# Altium project rpi-can-hat.PrjPcb
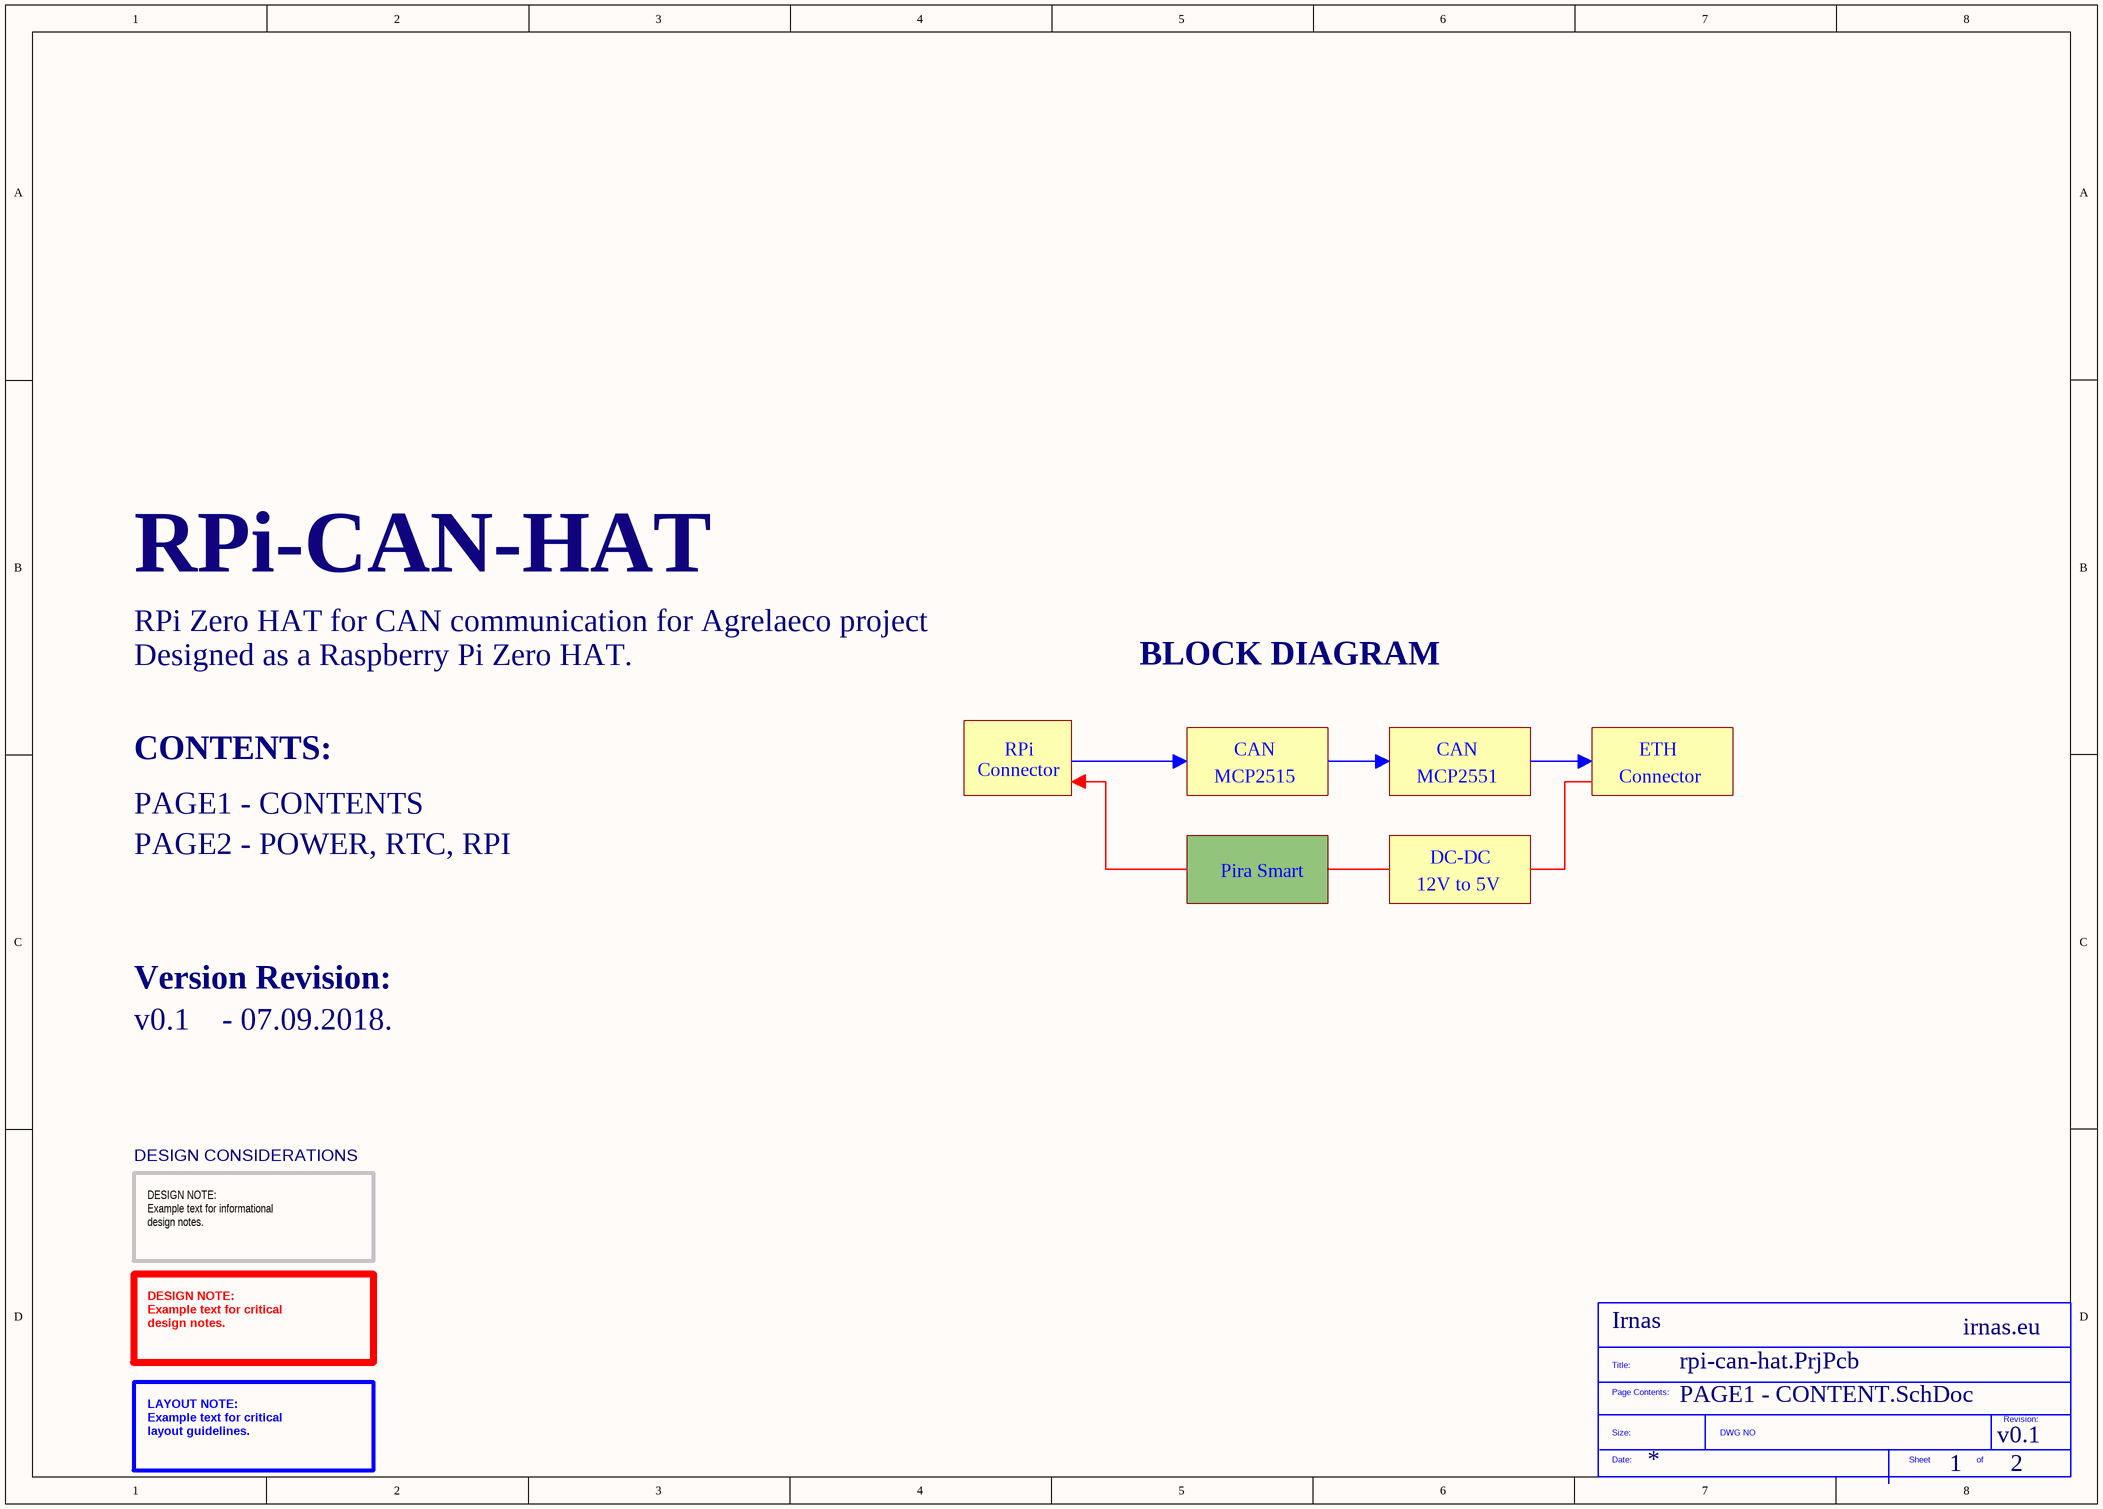
[diagram p0: PAGE1 - CONTENT.SchDoc]
Company: Irnas; ProjectTitle: RPi-CAN-HAT; Version: v0.1; Website: irnas.eu
2 sheets, 27 parts. Net scope: global (net labels, ports and power ports of the same name join across sheets).
Board file: rpi-can-hat.PcbDoc
Sheets:
  PAGE1 - CONTENT.SchDoc
  PAGE2 - RPI, CAN.SchDoc

## Sheet PAGE1 - CONTENT.SchDoc
size A3; DocumentNumber: 1; SheetNumber: 1; SheetTotal: 2

### Parts
(Parts that share a designator on the sheet are numbered #1, #2 ... from top to bottom, then left to right.)
*?#1  SDTitleBlock  (value not drawn)  (graphical)

### Notes on the sheet
- RPi Zero HAT for CAN communication for Agrelaeco project
- Designed as a Raspberry Pi Zero HAT.
- BLOCK DIAGRAM
- CONTENTS:
- Connector
- RPi
- MCP2515
- CAN
- MCP2551
- ETH
- PAGE1 - CONTENTS
- PAGE2 - POWER, RTC, RPI
- Pira Smart
- 12V to 5V
- DC-DC
- Version Revision:
- v0.1    - 07.09.2018.
- DESIGN CONSIDERATIONS
- DESIGN NOTE:
  Example text for informational
  design notes.
- DESIGN NOTE:
  Example text for critical
  design notes.
- LAYOUT NOTE:
  Example text for critical
  layout guidelines.
- (in symbol SDTitleBlock) Title:; Page Contents:; Revision:; Size:; DWG NO; Date:; Sheet; of

## Sheet PAGE2 - RPI, CAN.SchDoc
size A3; DocumentNumber: 2; SheetNumber: 2; SheetTotal: 2
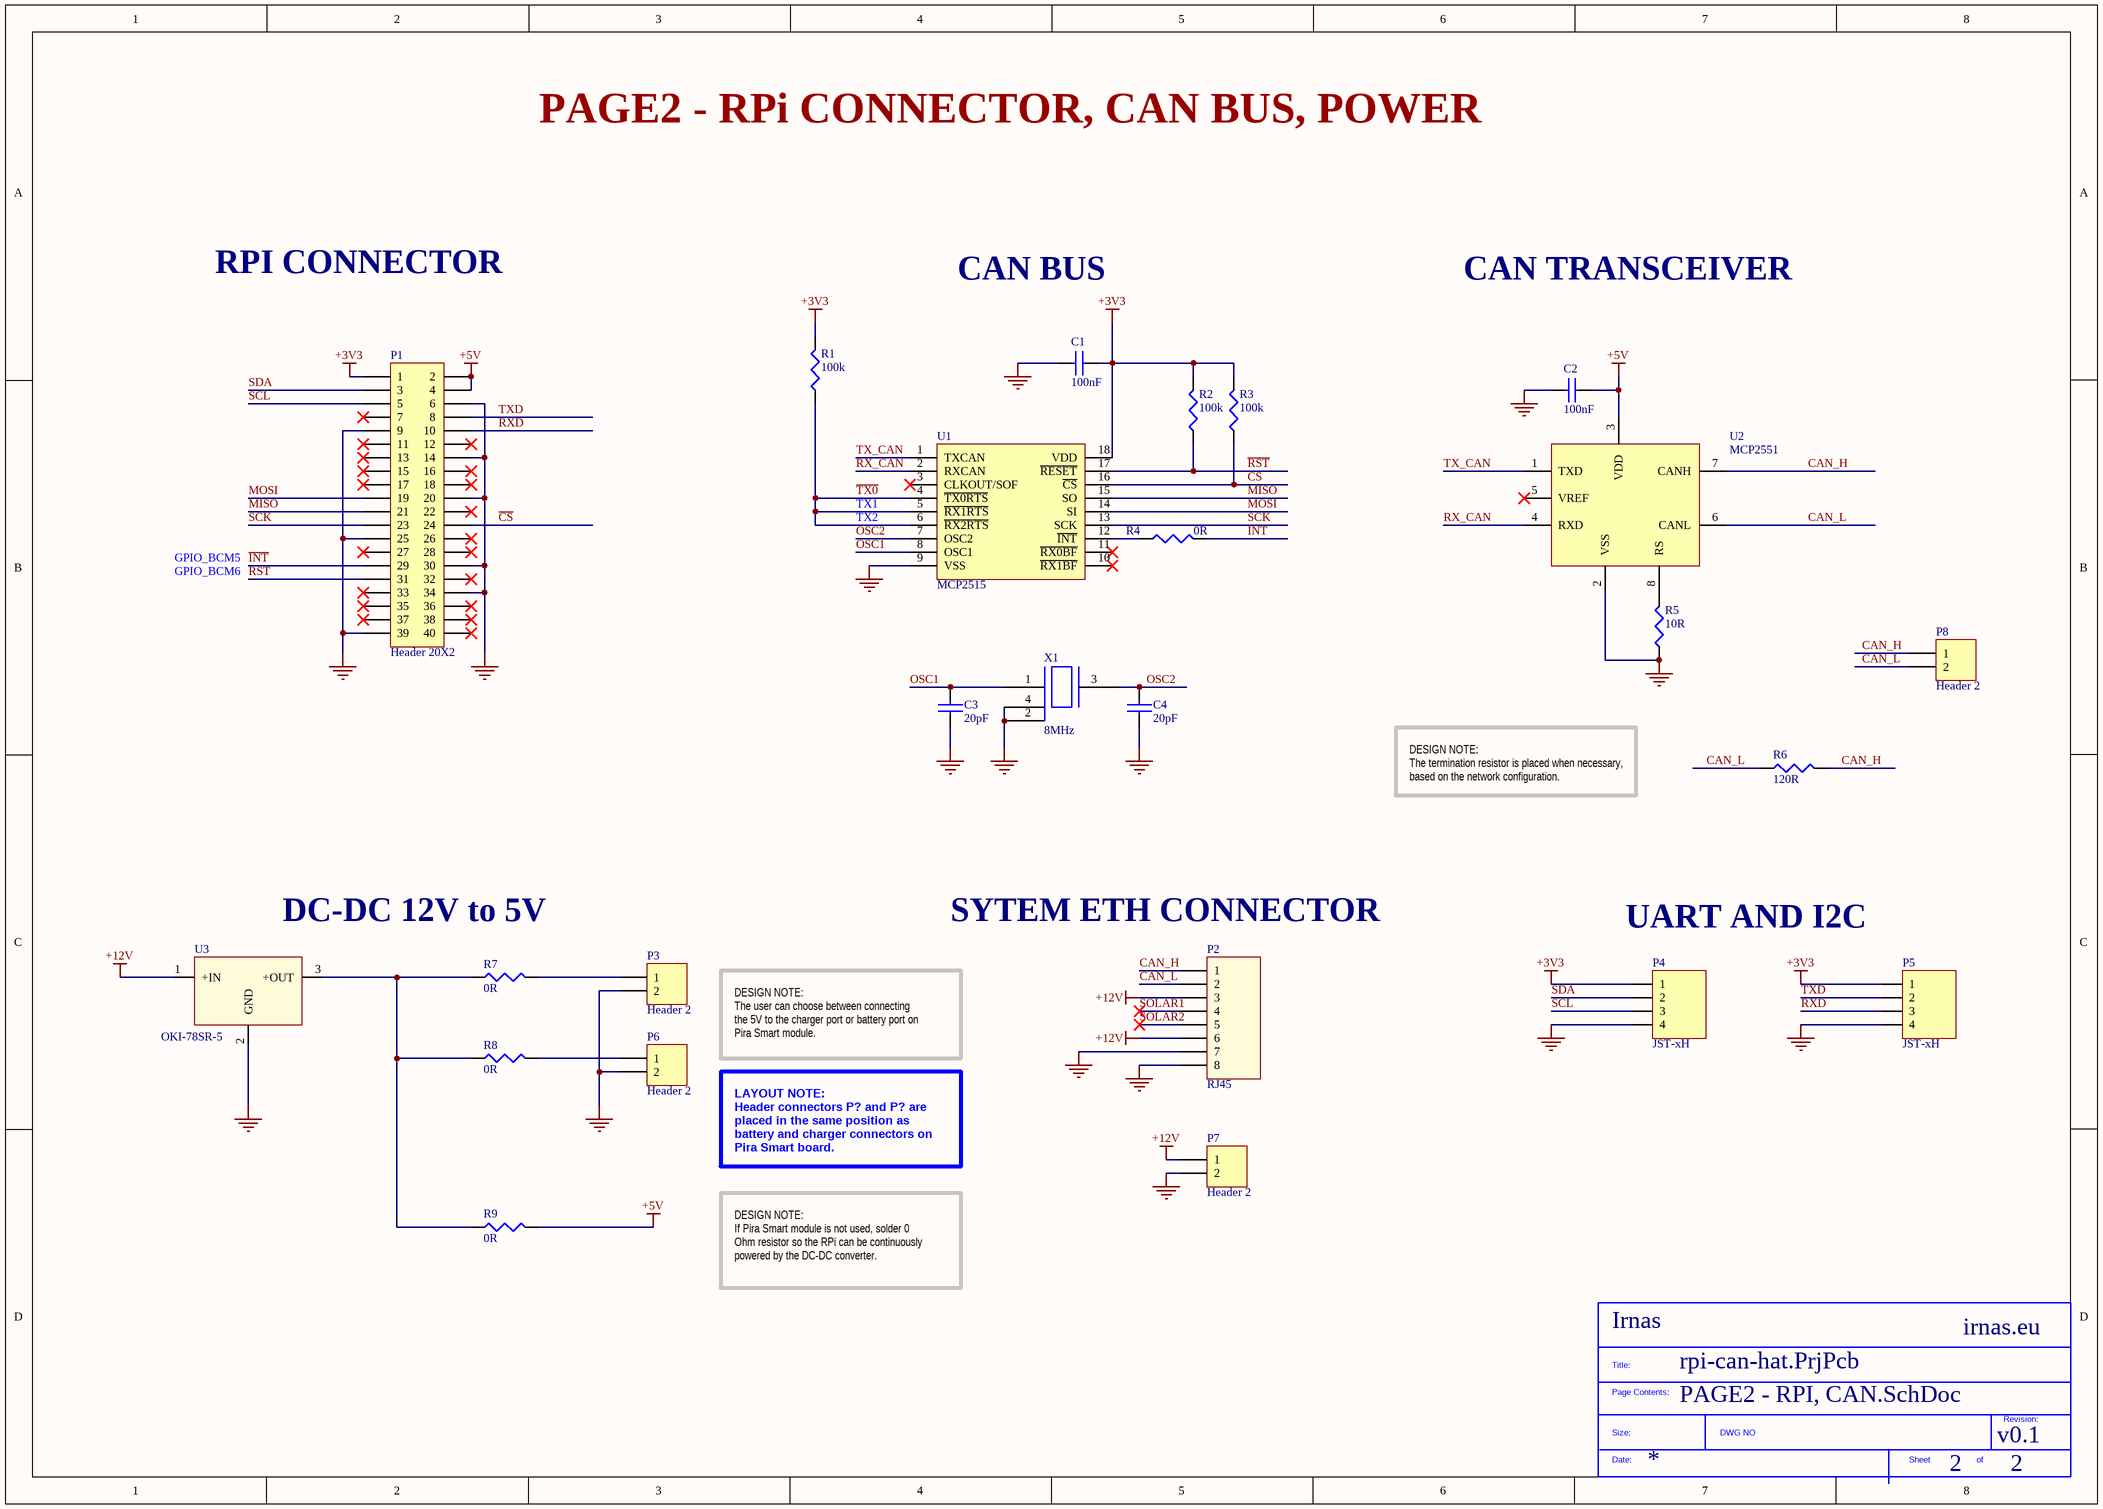
[diagram p1: PAGE2 - RPI, CAN.SchDoc]

### Parts
(Parts that share a designator on the sheet are numbered #1, #2 ... from top to bottom, then left to right.)
*?#2  SDTitleBlock  (value not drawn)  (graphical)
C1  100nF  [CAP0603]
C2  100nF  [CAP0603]
C3  20pF  [CAP0603]
C4  20pF  [CAP0603]
P1  Header 20X2  [HDR2X20]  (no BOM)
P2  RJ45  [EThernet conn]
P3  Header 2  [HDR1X2]
P4  JST-xH  [JST-xH]
P5  JST-xH  [JST-xH]
P6  Header 2  [HDR1X2]
P7  Header 2  [HDR1X2]
P8  Header 2  [HDR1X2]
R1  100k  [RES0603]
R2  100k  [RES0603]
R3  100k  [RES0603]
R4  0R  [RES0603]
R5  10R  [RES0603]
R6  120R  [RES0603]
R7  0R  [RES0603]
R8  0R  [RES0603]
R9  0R  [RES0603]
U1  MCP2515  [SOIC127P1030X264-18N]
U2  MCP2551  [SOIC127P600X175-8N]
U3  OKI-78SR-5  [DC-DC]
X1  8MHz  [DFN-Crystal]

### Nets
+3V3: C1.1 P1.1 P4.1 P5.1 R1.2 R2.2 R3.2 U1.18(VDD)
+5V: C2.1 P1.2 P1.4 R9.2 U2.3(VDD)
+12V: P2.3 P2.6 P7.1 U3.1(+IN)
GND: C1.2 C2.2 C3.1 C4.1 P1.6 P1.9 P1.14 P1.20 P1.25 P1.30 P1.34 P1.39 P2.7 P2.8 P3.2 P4.4 P5.4 P6.2 P7.2 R5.1 U1.9(VSS) U2.2(VSS) U3.2(GND) X1.2(GND) X1.4(GND)
~{CS}: P1.24 R3.1 U1.16(~{CS})
CAN_H: P2.1 P8.1 R6.2 U2.7(CANH)
CAN_L: P2.2 P8.2 R6.1 U2.6(CANL)
~{INT}: P1.29 R4.2
MISO: P1.21 U1.15(SO)
MOSI: P1.19 U1.14(SI)
OSC1: C3.2 U1.8(OSC1) X1.1
OSC2: C4.2 U1.7(OSC2) X1.3
~{RST}: P1.31 R2.1 U1.17(~{RESET})
RX_CAN: U1.2(RXCAN) U2.4(RXD)
RXD: P1.10 P5.3
SCK: P1.23 U1.13(SCK)
SCL: P1.5 P4.3
SDA: P1.3 P4.2
SOLAR1: P2.4
SOLAR2: P2.5
~{TX0}: R1.1 U1.4(~{TX0RTS}) U1.5(~{RX1RTS}) U1.6(~{RX2RTS})
TX_CAN: U1.1(TXCAN) U2.1(TXD)
TXD: P1.8 P5.2
NetP3_1: P3.1 R7.2
NetP6_1: P6.1 R8.2
NetR4_1: R4.1 U1.12(~{INT})
NetR5_2: R5.2 U2.8(RS)
NetR7_1: R7.1 R8.1 R9.1 U3.3(+OUT)

Not connected (* = marked no-connect by the designer): P1 7* 11* 12* 13* 15* 16* 17* 18* 22* 26* 27* 28* 32* 33* 35* 36* 37* 38* 40*; U1 3(CLKOUT/SOF)* 10(~{RX1BF})* 11(~{RX0BF})*; U2 5(VREF)*

### Notes on the sheet
- PAGE2 - RPi CONNECTOR, CAN BUS, POWER
- RPI CONNECTOR
- CAN BUS
- CAN TRANSCEIVER
- TX1
- GPIO_BCM5
- GPIO_BCM6
- TX2
- DESIGN NOTE:
  The termination resistor is placed when necessary, based on the network configuration.
- DC-DC 12V to 5V
- (near P2) SYTEM ETH CONNECTOR
- (near P4) UART AND I2C
- DESIGN NOTE:
  The user can choose between connecting the 5V to the charger port or battery port on Pira Smart module.
- LAYOUT NOTE:
  Header connectors P? and P? are placed in the same position as battery and charger connectors on Pira Smart board.
- DESIGN NOTE:
  If Pira Smart module is not used, solder 0 Ohm resistor so the RPi can be continuously powered by the DC-DC converter.
- (in symbol SDTitleBlock) Title:; Page Contents:; Revision:; Size:; DWG NO; Date:; Sheet; of

### Library data of the parts
C1 C2 = 100nF: MURATA - GRM188R71C104KA01J - CAP, MLCC, X7R, 0.1UF, 16V, 0603; Ceramic Capacitor Case: 0603 [1608 Metric]; Capacitance: 0.1; Voltage Rating: 16; Capacitance Tolerance: ± 10%; Dielectric Characteristic: X7; Product Range: GRM Series; SVHC: No SVHC (20-Jun-2016; Supplier 1: Farnell; Manufacturer: MURATA; Manufacturer Part Number: GRM188R71C104KA01J; RoHS: YES; Stock 1: 18297; Pricing 1: 10=0.0145, 100=0.0126, 500=0.0081, 2500=0.0059, 5000=0.0052, 10000=0.0046, 50000=0.0036, 100000=0.0035 (GBP); Packaging: Cut Tape; Operating Temperature Min: -55; Operating Temperature Max: 125; Automotive Qualification Standard: -; MSL: MSL 1 - Unlimited; ComponentLink1URL: http://www.farnell.com/datasheets/2189124.pdf; ComponentLink1Description: http://www.farnell.com/datasheets/2189124.pdf; Supplier Part Number 1: 2688519
C3 C4 = 20pF: MURATA - GRM1885C1H200JA01D - CAPACITOR, MLCC, C0G, 20PF, 50V, 0603; Ceramic Capacitor Case: 0603 [1608 Metric]; Capacitance: 20; Voltage Rating: 50; Capacitance Tolerance: ± 5%; Dielectric Characteristic: C0G / NP0; Product Range: GRM Series; SVHC: No SVHC (17-Dec-2015; Supplier 1: Farnell; Manufacturer: MURATA; Manufacturer Part Number: GRM1885C1H200JA01D; RoHS: YES; Stock 1: 5812; Pricing 1: 10=0.0245, 100=0.0159, 500=0.0123, 1000=0.0095, 2000=0.0093, 4000=0.0073, 20000=0.0062, 40000=0.0057 (GBP); Packaging: Cut Tape; Operating Temperature Min: -55; Operating Temperature Max: 125; Automotive Qualification Standard: -; MSL: MSL 1 - Unlimited; ComponentLink1URL: http://www.farnell.com/datasheets/2048077.pdf; ComponentLink1Description: http://www.farnell.com/datasheets/2048077.pdf; Supplier Part Number 1: 2456108
P1 = Header 20X2: Header, 20-Pin, Dual row; LatestRevisionDate: 17-Jul-2002; LatestRevisionNote: Re-released for DXP Platform.; Publisher: Altium Limited
P2 = 44620-0001: MODULAR JACK; Manufacturer: Molex; Number of Contacts: 8; Rad Hard: No; Gender: RCP; Pitch: 2.04 mm; Body Orientation: Right Angle; Supplier 1: Farnell; Manufacturer Part Number: 44620-0001; Stock 1: 1202; Pricing 1: 1=0.689, 50=0.675, 100=0.67, 250=0.669, 500=0.668, 1000=0.667 (EUR); Type: RJ-45; Termination Method: Solder; Mounting: Through Hole; Category: Connector Telephone and Telecom; ComponentLink1URL: https://datasheet.ciiva.com/26929/getdatasheetpartid-767379-26929525.pdf; ComponentLink1Description: https://datasheet.ciiva.com/26929/getdatasheetpartid-767379-26929525.pdf; ComponentLink2URL: https://datasheet.ciiva.com/19472/2040276-19472615.pdf; ComponentLink2Description: https://datasheet.ciiva.com/19472/2040276-19472615.pdf; ComponentLink3URL: https://datasheet.ciiva.com/30213/71510446200001-modular-jacks-plug-30213975.pdf; ComponentLink3Description: https://datasheet.ciiva.com/30213/71510446200001-modular-jacks-plug-30213975.pdf; ComponentLink4URL: https://datasheet.ciiva.com/4562/0446200001-modular-jacks-plug-145952-4562632.pdf; ComponentLink4Description: https://datasheet.ciiva.com/4562/0446200001-modular-jacks-plug-145952-4562632.pdf; ComponentLink5URL: https://datasheet.ciiva.com/16074/832720446200001-modular-jacks-plug-16074650.pdf; ComponentLink5Description: https://datasheet.ciiva.com/16074/832720446200001-modular-jacks-plug-16074650.pdf; ComponentLink6URL: https://datasheet.ciiva.com/1107/66995-1107778.pdf; ComponentLink6Description: https://datasheet.ciiva.com/1107/66995-1107778.pdf; ComponentLink7URL: https://datasheet.ciiva.com/9393/0446200001-modular-jacks-plug-9393019.pdf; ComponentLink7Description: https://datasheet.ciiva.com/9393/0446200001-modular-jacks-plug-9393019.pdf; ComponentLink8URL: https://datasheet.ciiva.com/16649/0446200001-modular-jacks-plug-16649582.pdf; ComponentLink8Description: https://datasheet.ciiva.com/16649/0446200001-modular-jacks-plug-16649582.pdf; Supplier Part Number 1: 2782009
P3 P6-P8 = Header 2: Header, 2-Pin; LatestRevisionDate: 17-Jul-2002; LatestRevisionNote: Re-released for DXP Platform.; Publisher: Altium Limited
P4 P5 = B4B-XH-A(LF)(SN): 4 Positions Header, Shrouded Connector 0.098" (2.50mm) Through Hole Tin; Manufacturer: JST; No of Positions: 4; Pitch: 2.5 mm; Style/Orientation: Straight Header/Plug; Voltage Rating: 250 V; Current Rating: 3 A; No of Rows: 1; Gender: Male; Mating Type: Detent Lock; Insulation Resistance: 1000 MΩ; Supplier 1: Farnell; Manufacturer Part Number: B4B-XH-A(LF)(SN); Stock 1: 0; Termination: Crimp; Operating Temp Range: -25 to +85 °C; Contact Material: Brass; Contact Plating: Tin; Material: Polyamide; Type: Shrouded Header; Color: Natural; ComponentLink1URL: https://datasheet.ciiva.com/26894/getdatasheetpartid-455616-26894787.pdf; ComponentLink1Description: https://datasheet.ciiva.com/26894/getdatasheetpartid-455616-26894787.pdf; ComponentLink2URL: https://datasheet.ciiva.com/26924/getdatasheetpartid-640571-26924035.pdf; ComponentLink2Description: https://datasheet.ciiva.com/26924/getdatasheetpartid-640571-26924035.pdf; ComponentLink3URL: https://datasheet.ciiva.com/16203/b4b-xh-alfsn-16203642.pdf; ComponentLink3Description: https://datasheet.ciiva.com/16203/b4b-xh-alfsn-16203642.pdf; ComponentLink4URL: https://datasheet.ciiva.com/726/exh-726404.pdf; ComponentLink4Description: https://datasheet.ciiva.com/726/exh-726404.pdf; Supplier Part Number 1: 1516278
R1-R3 = 100k: MULTICOMP - MCMR06X104 JTL - RES, CERAMIC, 100K, 5%, 0.1W, 0603; Resistance: 100; Voltage Rating: 75; Resistor Case Style: 0603 [1608 Metric]; Product Range: MCMR Series; Temperature Coefficient: ± 100; Resistor Mounting: Surface Mount Device<!--FANDB--><div class="features-and-benefits-container"><div class="features-and-benefits-description"><span class="features-benefits-value">The Multicomp MCMR series resistors are automotive grade, anti sulphured thick film chip resistor. The resistance range includes E24 and E96 decade values from 1ohm to 10Mohm. These resistors are constructed on top of a high grade ceramic body.</span></div><div class="features-and-benefits-list"><ul class="features-and-benefits-list-list"><li class="features-and-benefits-list-item">EIA 0402, 0603, 0805, 1206 chip sizes available</li><li class="features-and-benefits-list-item">High reliability and stability</li><li class="features-and-benefits-list-item">Automotive grade AEC-Q200 compliant</li><li class="features-and-benefits-list-item">Complaint with (IEC 60068-1) 55/155/56 climatic category</li><li class="features-and-benefits-list-item">Maximum operation voltage of 50V, 75V, 150V and 200V</li><li class="features-and-benefits-list-item">Power rating of 62.5mW, 100mW, 125mW and 250mW</li><li class="features-and-benefits-list-item">Available in ±1% and ±5% tolerance</li><li class="features-and-benefits-list-item">Temperature coefficient (TCR) of +200ppm/°C, +100ppm/°C and -200ppm/°C to +400ppm/°C</li><li class="features-and-benefits-list-item">Operating temperature range -55°C to 155; Supplier 1: Farnell; Manufacturer: MULTICOMP; Manufacturer Part Number: MCMR06X104 JTL; RoHS: Y-EX; Stock 1: 187; Pricing 1: 10=0.0109, 100=0.0085, 500=0.006, 1000=0.0048, 2500=0.004, 5000=0.003, 25000=0.002, 50000=0.0016 (GBP); Power Rating: 100; Resistance Tolerance: ± 5%; Packaging: Cut Tape; Resistor Element Material: Ceramic; Automotive Qualification Standard: -; ComponentLink1URL: http://www.farnell.com/datasheets/1716707.pdf; ComponentLink1Description: http://www.farnell.com/datasheets/1716707.pdf; Supplier Part Number 1: 2073357
R4 R7-R9 = 0R: BOURNS - CR0603-J/-000ELF - RES, THICK FILM, 0R, 5%, 0.1W, 0603; Resistance: 0; Voltage Rating: 50; Resistor Case Style: 0603 [1608 Metric]; Power Rating: 100; Product Range: CR Series; SVHC: No SVHC (17-Dec-2015); Resistor Mounting: Surface Mount Device<!--FANDB--><div class="features-and-benefits-container"><div class="features-and-benefits-description"><span class="features-benefits-value">The Bourns CR series are standard thick film chip resistors. These resistors provide flexibility of performance, space saving and low cost. The Resistance range includes E96 and E24 decade values from 1ohm to 10Mohm.</span></div><div class="features-and-benefits-list"><ul class="features-and-benefits-list-list"><li class="features-and-benefits-list-item">0201, 0402, 0603, 0805, 1206, 1210, 2010, 2512 standard case sizes available</li><li class="features-and-benefits-list-item">±1% and ±5% tolerance</li><li class="features-and-benefits-list-item">±100ppm/°C, ±200ppm/°C and ±250ppm/°C TCR values available</li><li class="features-and-benefits-list-item">Power rating selectable for 50mW, 63mW, 0.1W, 0.125W, 0.25W, 0.5W and 1W based on ordering</li><li class="features-and-benefits-list-item">Jumpers are available for all size</li><li class="features-and-benefits-list-item">3 layer termination process with nickel barrier prevents leaching & provides excellent solderability</li><li class="features-and-benefits-list-item">Suitable for all type of soldering processes</li><li class="features-and-benefits-list-item">Tight dimensional tolerances</li><li class="features-and-benefits-list-item">Maximum working voltage depends on case size</li><li class="features-and-benefits-list-item">Operating temperature of -55°C to +125°C(CR0201) and -55°C to +155; Supplier 1: Farnell; Manufacturer: BOURNS; Manufacturer Part Number: CR0603-J/-000ELF; RoHS: YES; Stock 1: 58200; Pricing 1: 10=0.0146, 250=0.0097, 1000=0.0073, 5000=0.0049, 12500=0.0042 (GBP); Resistance Tolerance: ± 5%; Packaging: Cut Tape; Resistor Element Material: Thick Film; Temperature Coefficient: -; Automotive Qualification Standard: -; MSL: MSL 1 - Unlimited; ComponentLink1URL: http://www.bourns.com/engineering/CHPREZTR/cr0603.stp; ComponentLink1Description: http://www.bourns.com/engineering/CHPREZTR/cr0603.stp; ComponentLink2URL: http://www.farnell.com/datasheets/2178762.pdf; ComponentLink2Description: http://www.farnell.com/datasheets/2178762.pdf; Supplier Part Number 1: 2008343
R5 = 10R: VISHAY - RCA060310R0FKEA - RES, AUTO, THICK FILM, 10R, 1%, 0603; Resistance: 10; Voltage Rating: 75; Resistor Case Style: 0603 [1608 Metric]; Power Rating: 100; Product Range: RCA Series; Temperature Coefficient: ± 100; Automotive Qualification Standard: AEC-Q200; SVHC: No SVHC (17-Dec-2015)<!--FANDB--><div class="features-and-benefits-container"><div class="features-and-benefits-description"><span class="features-benefits-value">The RCA series from Vishay are automotive grade, sulphur resistant thick film rectangular chip resistors. The resistance range includes E24 and E96 decade values from 1ohm to 10Mohm. They provide superior resistance against H2S atmosphere. These resistors have metal glaze on high quality ceramic.</span></div><div class="features-and-benefits-list"><ul class="features-and-benefits-list-list"><li class="features-and-benefits-list-item">Automotive grade AEC-Q200 qualified (rev C)</li><li class="features-and-benefits-list-item">EIA 0402, 0603, 0805, 1206, 1210, 1218, 2010 and 2512 case sizes available</li><li class="features-and-benefits-list-item">Available in ±0.5%, ±1% and ±5% tolerances</li><li class="features-and-benefits-list-item">Jumpers are also available</li><li class="features-and-benefits-list-item">±50ppm/K, ±100ppm/K and ±200ppm/K TCR values</li><li class="features-and-benefits-list-item">Power rating of 0.063W, 0.10W, 0.125W, 0.25W, 0.5W, 0.75W and 1W at 70?C</li><li class="features-and-benefits-list-item">Available in 50V, 75V, 150V, 200V, 400V and 500V limiting voltage options</li><li class="features-and-benefits-list-item">Category temperature range from -55?C to 155?C</li><li class="features-and-benefits-list-item">Stability ?R/R = 1 % for 1000h at 70; Supplier 1: Farnell; Manufacturer: VISHAY; Manufacturer Part Number: RCA060310R0FKEA; RoHS: YES; Stock 1: 9559; Pricing 1: 10=0.0803, 100=0.0386, 500=0.0235, 2500=0.015, 5000=0.0135, 10000=0.0108, 50000=0.0068, 100000=0.0067 (GBP); Resistance Tolerance: ± 1%; Packaging: Cut Tape; Resistor Element Material: Thick Film; ComponentLink1URL: http://www.farnell.com/datasheets/2111201.pdf; ComponentLink1Description: http://www.farnell.com/datasheets/2111201.pdf; Supplier Part Number 1: 2616585
R6 = 120R: RES SMD 120 OHM 1% 1/4W 0603; Manufacturer: Vishay; Manufacturer Part Number: CRCW0603120RFKEAHP; Voltage Rating: 75V; Power Rating: 250mW; Temperature Coefficient: 100ppm/°C; Supplier 1: Farnell; Stock 1: 34760; Pricing 1: 10=0.141, 100=0.0937, 500=0.0669, 1000=0.0453 (EUR); Case/Package: 0603; Contact Plating: Tin; Case Code (Metric): 1608; Case Code (Imperial): 0603; Min Operating Temperature: -55°C; Max Operating Temperature: 155°C; Package Quantity: 5000; Packaging: Tape and Reel; Termination: SMD/SMT; Resistance: 120R; Tolerance: 1%; Composition: Thick Film; Number of Terminations: 2; Military Standard: Not; Max Power Dissipation: 250mW; Features: Automotive AEC-Q200; Length: 1.6mm; Height: 0.022inch; Width: 0.033inch; Depth: 0.85mm; Radiation Hardening: No; REACH SVHC: Unknown; ComponentLink1URL: https://datasheet.ciiva.com/5852/424479-5852064.pdf; ComponentLink1Description: https://datasheet.ciiva.com/5852/424479-5852064.pdf; ComponentLink2URL: https://datasheet.ciiva.com/2578/crcwhpe3-2578529.pdf; ComponentLink2Description: https://datasheet.ciiva.com/2578/crcwhpe3-2578529.pdf; ComponentLink3URL: https://datasheet.ciiva.com/8975/crcwhpe3-8975275.pdf; ComponentLink3Description: https://datasheet.ciiva.com/8975/crcwhpe3-8975275.pdf; ComponentLink4URL: https://datasheet.ciiva.com/7777/424479-7777277.pdf; ComponentLink4Description: https://datasheet.ciiva.com/7777/424479-7777277.pdf; ComponentLink5URL: https://datasheet.ciiva.com/7777/424479-7777278.pdf; ComponentLink5Description: https://datasheet.ciiva.com/7777/424479-7777278.pdf; Supplier Part Number 1: 1738892
U1 = MCP2515-I/SO: MICROCHIP         MCP2515-I/SO             CAN Bus, Controller, SPI, 3, 2, 2.7 V, 5.5 V, SOIC; Interface: SPI,CAN; Number of Transmit Buffers: 3; Number of Receive Buffers: 2; Min Supply Voltage: 2.7V; Max Supply Voltage: 5.5V; Data Rate: 1Mbps; Nominal Supply Current: 10mA; Operating Supply Voltage: 5V; Number of Transceivers: 1; Frequency: 40MHz; Supplier 1: Farnell; Manufacturer: Microchip; Manufacturer Part Number: MCP2515-I/SO; Stock 1: 2836; Pricing 1: 1=1.4, 10=1.29, 25=1.17, 100=1.06 (GBP); Mount: Surface Mount; Case/Package: SOIC; Number of Pins: 18; Contact Plating: Tin,Matte; Min Operating Temperature: -40°C; Max Operating Temperature: 85°C; Packaging: Rail/Tube; Max Supply Current: 10mA; Number of Drivers: 1; Number of Receivers: 1; Length: 11.53mm; Height: 2.31mm; Width: 7.49mm; Radiation Hardening: No; Lead Free: Lead Free; REACH SVHC: No SVHC; ComponentLink1URL: https://datasheet.ciiva.com/14152/ea644222-e-14152533.pdf; ComponentLink1Description: https://datasheet.ciiva.com/14152/ea644222-e-14152533.pdf; ComponentLink2URL: https://datasheet.ciiva.com/15150/getdatasheetpartid-446809-15150054.pdf; ComponentLink2Description: https://datasheet.ciiva.com/15150/getdatasheetpartid-446809-15150054.pdf; ComponentLink3URL: https://datasheet.ciiva.com/16205/filehandler-aspxddocname-en011733-16205222.pdf; ComponentLink3Description: https://datasheet.ciiva.com/16205/filehandler-aspxddocname-en011733-16205222.pdf; ComponentLink4URL: https://datasheet.ciiva.com/18405/70045398-18405546.pdf; ComponentLink4Description: https://datasheet.ciiva.com/18405/70045398-18405546.pdf; ComponentLink5URL: https://datasheet.ciiva.com/1495/1669372-1495083.pdf; ComponentLink5Description: https://datasheet.ciiva.com/1495/1669372-1495083.pdf; ComponentLink6URL: https://datasheet.ciiva.com/1695/21801g-1695405.pdf; ComponentLink6Description: https://datasheet.ciiva.com/1695/21801g-1695405.pdf; ComponentLink7URL: https://datasheet.ciiva.com/29305/651448-da-01-en-ic-can-cont-mcp2515-i-so-soic-18-mcp-29305158.pdf; ComponentLink7Description: https://datasheet.ciiva.com/29305/651448-da-01-en-ic-can-cont-mcp2515-i-so-soic-18-mcp-29305158.pdf; Supplier Part Number 1: 1292239
U2 = MCP2551-I/SN: MICROCHIP         MCP2551-I/SN             CAN Bus, Transceiver, CAN, 1, 1, 4.5 V, 5.5 V, SOIC; Slew Rate: 8.5V/µs; Data Rate: 1Mbps; Max Supply Voltage: 5.5V; Operating Supply Voltage: 5V; Min Supply Voltage: 4.5V; Nominal Supply Current: 75mA; Number of Transmit Buffers: 1; Supplier 1: Farnell; Manufacturer: Microchip; Manufacturer Part Number: MCP2551-I/SN; Stock 1: 28021; Pricing 1: 1=0.79, 10=0.723, 25=0.656, 100=0.602 (GBP); Mount: Surface Mount; Case/Package: SOIC; Number of Pins: 8; Number of Terminals: 8; Contact Plating: Tin,Matte; Min Operating Temperature: -40°C; Max Operating Temperature: 85°C; Packaging: Rail/Tube; Number of Receive Buffers: 1; Package Quantity: 100; Interface: CAN; Number of Transceivers: 1; Max Supply Current: 75mA; Number of Drivers: 1; Number of Receivers: 1; Logic Function: Transceiver; Length: 4.9mm; Height: 1.25mm; Width: 3.9mm; Radiation Hardening: No; REACH SVHC: No SVHC; Lead Free: Lead Free; ComponentLink1URL: https://datasheet.ciiva.com/8084/jp011797-8084592.pdf; ComponentLink1Description: https://datasheet.ciiva.com/8084/jp011797-8084592.pdf; ComponentLink2URL: https://datasheet.ciiva.com/27056/2040583-27056423.pdf; ComponentLink2Description: https://datasheet.ciiva.com/27056/2040583-27056423.pdf; ComponentLink3URL: https://datasheet.ciiva.com/1495/21667f-1495089.pdf; ComponentLink3Description: https://datasheet.ciiva.com/1495/21667f-1495089.pdf; ComponentLink4URL: https://datasheet.ciiva.com/1700/21667f-1700023.pdf; ComponentLink4Description: https://datasheet.ciiva.com/1700/21667f-1700023.pdf; ComponentLink5URL: https://datasheet.ciiva.com/14152/eb644223-644224-e-14152540.pdf; ComponentLink5Description: https://datasheet.ciiva.com/14152/eb644223-644224-e-14152540.pdf; ComponentLink6URL: https://datasheet.ciiva.com/17649/jp011797-17649039.pdf; ComponentLink6Description: https://datasheet.ciiva.com/17649/jp011797-17649039.pdf; Supplier Part Number 1: 9758569
U3 = OKI-78SR-5/1.5-W36-C: Non-Isolated DC/DC Converters 7.5W 24Vin 5Vout1 1.5A SIP Non-Iso; Manufacturer: Murata; Power (Watts) - Manufacture Series: 8W; Number of Outputs: 1; Voltage - Input (Min): 7V; Voltage - Input (Max): 36V; Voltage - Output 1: 5V; Efficiency: 90.5%; Supplier 1: Farnell; Manufacturer Part Number: OKI-78SR-5/1.5-W36-C; Stock 1: 0; Category: Power Supplies - Board Mount; Family: DC DC Converters; Series: Okami™ OKI-78SR; Packaging: Tube; Type: Linear Regulator Replacement; Voltage - Output 2: -; Voltage - Output 3: -; Current - Output (Max): 1.5A; Voltage - Isolation: -; Applications: ITE (Commercial); Features: SCP; Mounting Type: Through Hole; Package / Case: 3-SIP Module; Size / Dimension: 0.41" L x 0.30" W x 0.65" H (10.4mm x 7.6mm x 16.5mm); Operating Temperature: -40°C ~ 85°C; Power (Watts) - Max: 8W; ComponentLink1URL: https://datasheet.ciiva.com/8006/1790439-8006672.pdf; ComponentLink1Description: https://datasheet.ciiva.com/8006/1790439-8006672.pdf; ComponentLink2URL: https://datasheet.ciiva.com/2374/oki-78sr-2374163.pdf; ComponentLink2Description: https://datasheet.ciiva.com/2374/oki-78sr-2374163.pdf; ComponentLink3URL: https://datasheet.ciiva.com/8220/oki-78sr-8220327.pdf; ComponentLink3Description: https://datasheet.ciiva.com/8220/oki-78sr-8220327.pdf; ComponentLink4URL: https://datasheet.ciiva.com/4646/oki-78sr-56393-4646361.pdf; ComponentLink4Description: https://datasheet.ciiva.com/4646/oki-78sr-56393-4646361.pdf; ComponentLink5URL: https://datasheet.ciiva.com/6917/1790439-6917306.pdf; ComponentLink5Description: https://datasheet.ciiva.com/6917/1790439-6917306.pdf; ComponentLink6URL: https://datasheet.ciiva.com/17327/oki-78sr-17327359.pdf; ComponentLink6Description: https://datasheet.ciiva.com/17327/oki-78sr-17327359.pdf; Supplier Part Number 1: 2102101
X1 = 8MHz: 8MHz ±10ppm Crystal 10pF 200 Ohm -10°C ~ 60°C  Surface Mount 4-SMD, No Lead (DFN, LCC); Manufacturer: Abracon; Manufacturer Part Number: ABM3B-8.000MHZ-10-1-U-T; ESR (Equivalent Series Resistance): 200 Ohm; Operating Mode: Fundamental; Stock 1: 0; Category: Crystals and Oscillators; Family: Crystals; Series: ABM3B; Packaging: Tape & Reel (TR); Type: MHz Crystal; Frequency: 8MHz; Frequency Stability: ±10ppm; Frequency Tolerance: ±10ppm; Load Capacitance: 10pF; Operating Temperature: -10°C ~ 60°C; Ratings: -; Mounting Type: Surface Mount; Package / Case: 4-SMD, No Lead (DFN, LCC); Size / Dimension: 0.197" L x 0.126" W (5.00mm x 3.20mm); Height: 0.043" (1.10mm); ComponentLink1URL: https://datasheet.ciiva.com/855/abm3b-855873.pdf; ComponentLink1Description: https://datasheet.ciiva.com/855/abm3b-855873.pdf; ComponentLink2URL: https://datasheet.ciiva.com/855/abm3b-855874.pdf; ComponentLink2Description: https://datasheet.ciiva.com/855/abm3b-855874.pdf; ComponentLink3URL: https://datasheet.ciiva.com/855/abm3b-855875.pdf; ComponentLink3Description: https://datasheet.ciiva.com/855/abm3b-855875.pdf; ComponentLink4URL: https://datasheet.ciiva.com/16378/abm3b-16378027.pdf; ComponentLink4Description: https://datasheet.ciiva.com/16378/abm3b-16378027.pdf; ComponentLink5URL: https://datasheet.ciiva.com/3175/abm3b-3175853.pdf; ComponentLink5Description: https://datasheet.ciiva.com/3175/abm3b-3175853.pdf; Supplier 1: Farnell; Supplier Part Number 1: 2467817RL